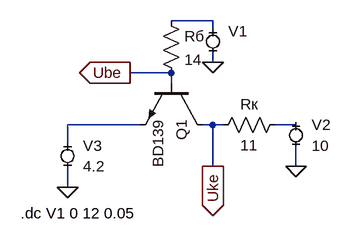
[diagram p0: schematic Key_NPN.asc]
Key_NPN.asc, the LTspice schematic file:
Version 4
SHEET 1 880 680
WIRE 48 64 -16 64
WIRE 48 80 48 64
WIRE 48 128 48 112
WIRE -16 144 -80 144
WIRE -16 160 -16 144
WIRE -64 224 -176 224
WIRE 48 224 32 224
WIRE 64 224 48 224
WIRE 176 224 144 224
WIRE -176 256 -176 224
WIRE 48 288 48 224
WIRE 176 288 176 256
WIRE -176 320 -176 288
FLAG 48 128 0
FLAG -176 320 0
FLAG 176 288 0
FLAG 48 288 Uke
IOPIN 48 288 Out
FLAG -80 144 Ube
IOPIN -80 144 Out
SYMBOL npn 32 160 R90
SYMATTR InstName Q1
SYMATTR Value BD139
SYMBOL MiniSyms4\\voltage- 48 96 R0
WINDOW 123 0 0 Left 2
WINDOW 39 0 0 Left 2
SYMATTR InstName V1
SYMATTR Value ""
SYMBOL res 160 208 R90
WINDOW 0 0 56 VBottom 2
WINDOW 3 32 56 VTop 2
SYMATTR InstName Rк
SYMATTR Value 11
SYMBOL MiniSyms4\\voltage- 176 240 R0
WINDOW 123 0 0 Left 2
WINDOW 39 0 0 Left 2
SYMATTR InstName V2
SYMATTR Value 10
SYMBOL MiniSyms4\\voltage- -176 272 R0
WINDOW 123 0 0 Left 2
WINDOW 39 0 0 Left 2
SYMATTR InstName V3
SYMATTR Value 4.2
SYMBOL res -32 48 R0
SYMATTR InstName Rб
SYMATTR Value 14
TEXT -248 360 Left 2 !.dc V1 0 12 0.05

The netlist it stands for:
* Key_NPN.asc
Q1 Uke Ube N002 0 BD139
V1 N001 0
Rк N003 Uke 11
V2 N003 0 10
V3 N002 0 4.2
Rб N001 Ube 14
.model NPN NPN
.model PNP PNP
.lib standard.bjt
.dc V1 0 12 0.05
.backanno
.end